# Altium schematic sheet USB.SchDoc
size A4; ApprovedBy: Krzysztof Belewicz; CheckedBy: Krzysztof Belewicz; Author: Krzysztof Belewicz; CompanyName: Koło Naukowe Systemów Scalonych; DrawnBy: Krzysztof Belewicz; Organization: KNSS; Address1: Koło Naukowe; Address2: Systemów Scalonych; Address3: 00-665 Warszawa; Address4: Nowowiejska 15/19; DocumentNumber: 1; Revision: 1.0; SheetNumber: 1; SheetTotal: 1
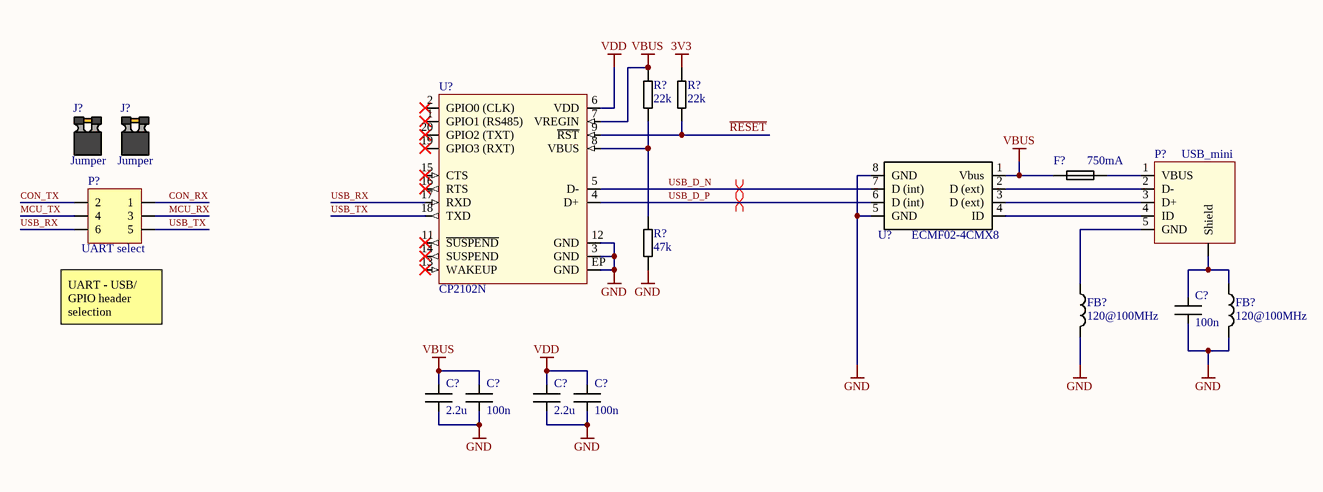
[diagram p0: USB.SchDoc]

## Parts
(Parts that share a designator on the sheet are numbered #1, #2 ... from top to bottom, then left to right.)
C?#1  100n  [CAPC1005N]
C?#2  value 2.2u  [CAPC1005N]  (hidden comment: Capacitor)
C?#3  100n  [CAPC1005N]
C?#4  value 2.2u  [CAPC1005N]  (hidden comment: Capacitor)
C?#5  100n  [CAPC1005N]
F?  Stand Current: 750mA  [RESC2012N]  (hidden comment: PTC Fuse)
FB?#1  120@100MHz  [INDC1005N]
FB?#2  120@100MHz  [INDC1005N]
J?#1  Jumper  [JUMPER-B]
J?#2  Jumper  [JUMPER-B]
P?#1  USB_mini  [MUSB-B5-S-RA-TSMT-CS1]
P?#2  UART select  [HDR2X3]
R?#1  value 22k  [RESC1005N]  (hidden comment: Resistor)
R?#2  value 22k  [RESC1005N]  (hidden comment: Resistor)
R?#3  value 47k  [RESC1005N]  (hidden comment: Resistor)
U?#1  CP2102N  [QFN-20]
U?#2  ECMF02-4CMX8  [uQFN-8]

## Nets
3V3: R?#2.2
GND: C?#1.1 C?#2.1 C?#3.1 C?#4.1 C?#5.1 FB?#1.2 FB?#2.2 R?#3.1 U?#1.3(GND) U?#1.12(GND) U?#1.EP(GND) U?#2.5(GND) U?#2.8(GND)
VBUS: C?#2.2 C?#3.2 F?.1 R?#1.2 U?#1.7(VREGIN) U?#2.1(Vbus)
VDD: C?#4.2 C?#5.2 U?#1.6(VDD)
CON_RX: P?#2.1
CON_TX: P?#2.2
MCU_RX: P?#2.3
MCU_TX: P?#2.4
~{RESET}: R?#2.1 U?#1.9(~{RST})
USB_D_N: U?#1.5(D-) U?#2.7(D_(int))
USB_D_P: U?#1.4(D+) U?#2.6(D_(int))
USB_RX: P?#2.6 U?#1.17(RXD)
USB_TX: P?#2.5 U?#1.18(TXD)
NetC?#1_2: C?#1.2 FB?#2.1 P?#1.0(Shield)
NetF?_2: F?.2 P?#1.1(VBUS)
NetFB?#1_1: FB?#1.1 P?#1.5(GND)
NetP?#1_2: P?#1.2(D-) U?#2.2(D_(ext))
NetP?#1_3: P?#1.3(D+) U?#2.3(D_(ext))
NetP?#1_4: P?#1.4(ID) U?#2.4(ID)
NetR?#1_1: R?#1.1 R?#3.2 U?#1.8(VBUS)

Not connected (* = marked no-connect by the designer): U?#1 1(GPIO1_(RS485))* 2(GPIO0_(CLK))* 11(~{SUSPEND})* 13(WAKEUP)* 14(SUSPEND)* 15(CTS)* 16(RTS)* 19(GPIO3_(RXT))* 20(GPIO2_(TXT))*

## Layout directives
differential pair: USB_D_N, USB_D_P

## Notes on the sheet
- (near P?#2) UART - USB/ GPIO header selection
- Project:
- Variant:
- File:
- Sheet:
- Revision:
- Total Sheet:
- Author:
- Modified:

## Library data of the parts
C?#1 C?#3 C?#5 = Capacitor: 0402 SMD Capacitor; Manufacturer Part Number 1: CL05B104KO5NNNC; Manufacturer 1: Samsung; Tolerance: 10%; MaxVoltage: 16V; Supplier 1: TME; Supplier 2: Farnell; Value: 100n; Supplier Part Number 1: CL05B104KO5NNNC; Manufacturer 2: Multicomp; Manufacturer Part Number 2: MC0402B104K100CT; Supplier Part Number 2: 2627343
C?#2 C?#4 = Capacitor: 0402 SMD Capacitor; Manufacturer 1: Samsung; Manufacturer Part Number 1: CL05A225KQ5NSNC; Tolerance: 10%; MaxVoltage: 6.3V; Supplier 1: TME; Supplier Part Number 1: CL05A225KQ5NSNC; Manufacturer Part Number 2: GRT155C80J225KE01D; Manufacturer 2: MURATA; Supplier Part Number 2: 2672104; Supplier 2: Farnell
F? = SD075-16: PTC Fuse 500mA; Manufacturer 1: ECE; Manufacturer Part Number 1: SR075-06; Max Voltage: 6V; Supplier 1: TME; Supplier Part Number 1: SR075-06
FB?#1 FB?#2 = Inductor: Ferrite Bead; Manufacturer 1: Murata; Manufacturer Part Number 1: BLM15PD121SN1D; Max Current: 1.3A; Tolerance: 25%; Supplier 1: TME; Value: 120@100MHz; Supplier Part Number 1: BLM15PD121SN1D; Manufacturer 2: Murata; Manufacturer Part Number 2: BLM15PD121SN1D; Supplier Part Number 2: 2443229; Supplier 2: Farnell
J?#1 J?#2 = Header Jumper Black: 1x2, 2.54mm Black header jumper; Manufacturer 1: NINIGI; Supplier 1: TME; SMD: No; Supplier Part Number 1: JUMPER-B; Socket: No; Manufacturer Part Number 1: JUMPER-B; Pin count: 0
P?#1 = MUSB-B5-S-RA-TSMT-CS1: Gniazdo; USB B mini; SMT; poziome; V: USB 2.0; złocony; Manufacturer 1: ADAM TECH; Supplier 1: TME; Supplier Part Number 1: MUSB-B5-S-RA-SMT; Manufacturer Part Number 1: MUSB-B5-S-RA-TSMT-CS1; SMD: Yes; Socket: No; Pin count: 5
P?#2 = Header 3X2: Header, 3-Pin, Dual row; LatestRevisionDate: 17-Jul-2002; LatestRevisionNote: Re-released for DXP Platform.; Publisher: Altium Limited
R?#1 R?#2 = Resistor: 0402 Film SMD Resistor; Manufacturer 1: TE CONNECTIVITY; Manufacturer Part Number 1: CRGCQ0402F22K; Tolerance: 1%; Power: 0.1W; Supplier 1: Farnell; Supplier Part Number 1: 2861416; Manufacturer Part Number 2: CRCW040222K0FKTDBC; Manufacturer 2: VISHAY; Supplier 2: TME; Supplier Part Number 2: CRCW040222K0FKTDBC
R?#3 = Resistor: 0402 Film SMD Resistor; Manufacturer 1: TE CONNECTIVITY; Manufacturer Part Number 1: CRGCQ0402F47K; Tolerance: 1%; Power: 0.1W; Supplier 1: Farnell; Supplier Part Number 1: 2861420; Manufacturer Part Number 2: 0402WGF4702TCE; Manufacturer 2: ROYAL OHM; Supplier 2: TME; Supplier Part Number 2: SMD0402-47K-1%
U?#1 = CP2102N: USB Interface IC USBXpress - USB to UART Bridge QFN20; Manufacturer Part Number 1: CP2102N-A01-GQFN20; Manufacturer 1: SILICON LABS; Manufacturer Part Number 2: CP2102N-A01-GQFN20; Supplier 1: Farnell; Supplier 2: Mouser; Supplier Part Number 1: 2577277; Manufacturer 2: SILICON LABS; Supplier Part Number 2: 634-CP2102NA01GQFN20; Pin count: 20; SMD: Yes; Socket: No
U?#2 = ECMF02-4CMX8: STMicroelectronics Common Mode Filter with ESD protection, USB compatible; Supplier 1: Farnell; Supplier Part Number 1: 2629721; Manufacturer: STMicroelectronics; Manufacturer Part Number: ECMF02-4CMX8